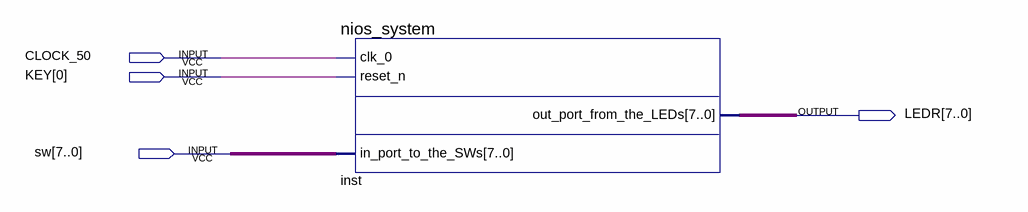
[diagram p0: schematic sheet]
// Quartus schematic niosGRAF.bdf as structural Verilog: 1 symbols, 4 pins
module niosGRAF (
  input  CLOCK_50,
  input  [0:0] KEY,
  input  [7:0] sw,
  output [7:0] LEDR
);

  nios_system inst (.clk_0(CLOCK_50), .reset_n(KEY[0]), .in_port_to_the_SWs(sw), .out_port_from_the_LEDs(LEDR));
endmodule
